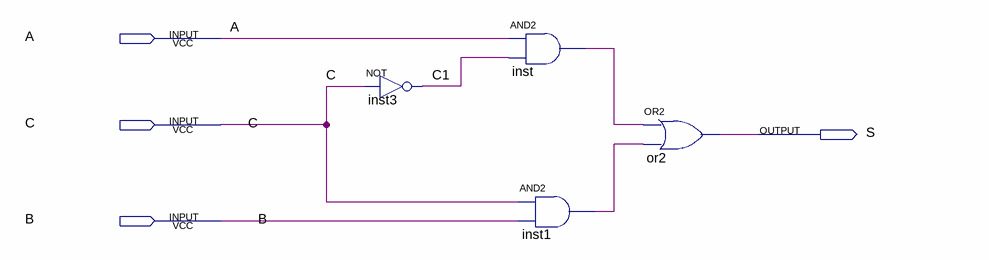
[diagram p0: schematic sheet]
// Quartus schematic mux2x1.bdf as structural Verilog: 4 symbols, 4 pins
module mux2x1 (
  input  A,
  input  C,
  input  B,
  output S
);

  wire C1, inst1_out, inst_out;

  not inst3 (C1, C);
  and inst (inst_out, A, C1);
  and inst1 (inst1_out, C, B);
  or or2 (S, inst_out, inst1_out);
endmodule
